# Altium schematic sheet Audio Jack schematic.SchDoc
size A4
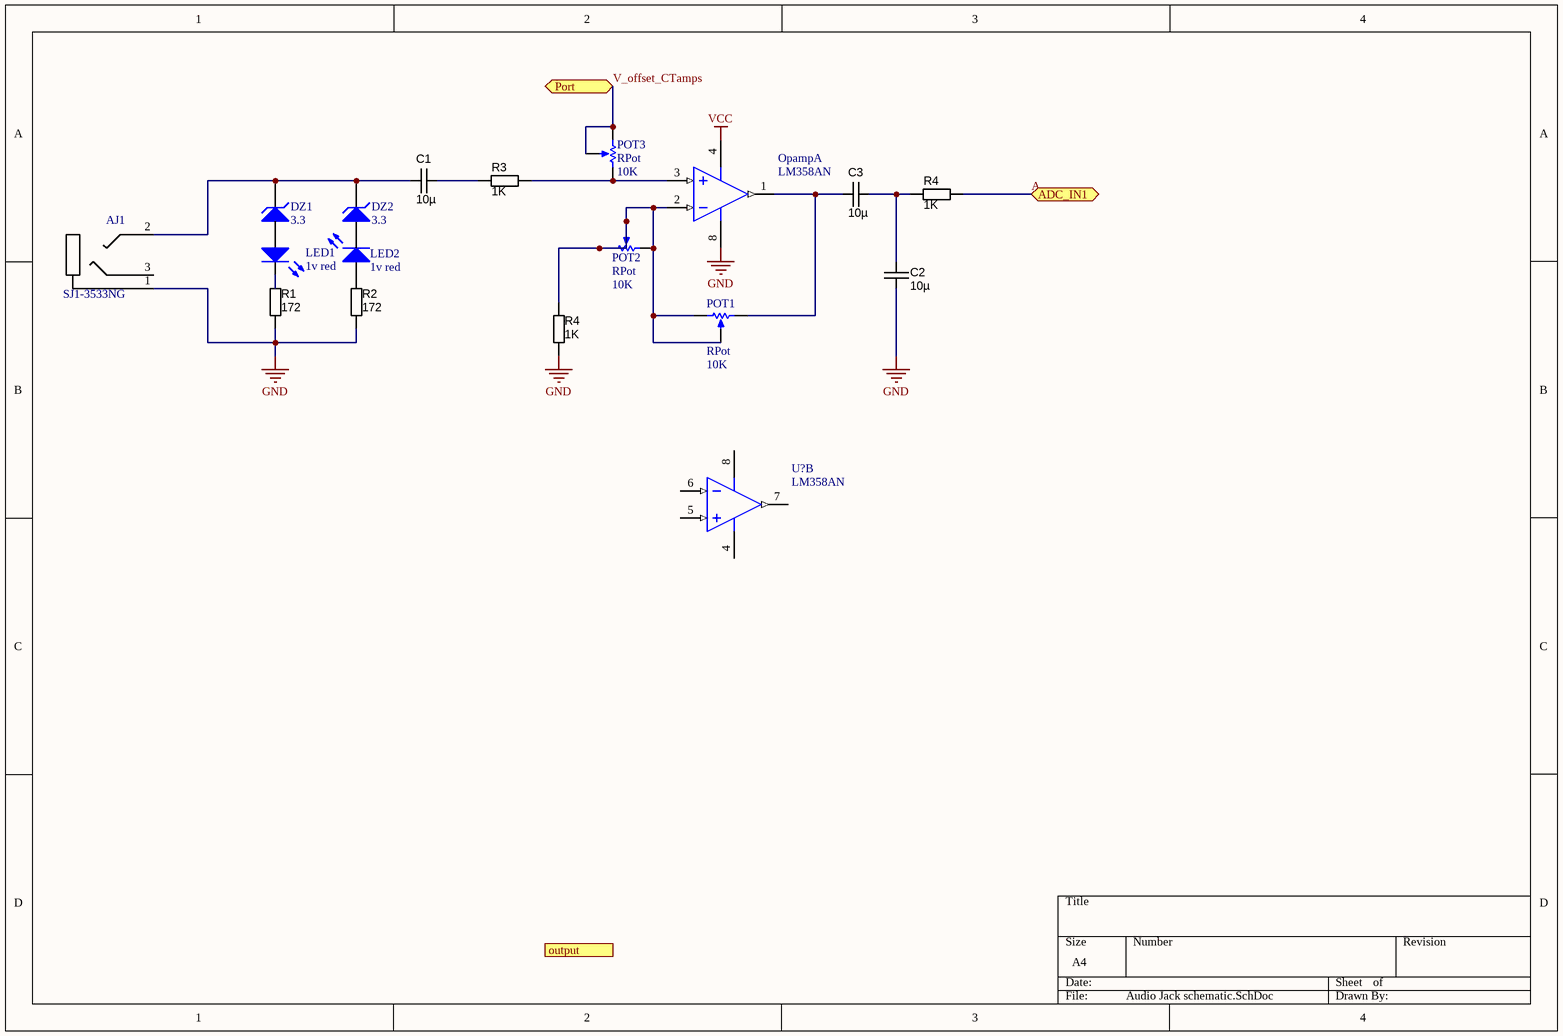
[diagram p0: Audio Jack schematic.SchDoc]

## Parts
(Parts that share a designator on the sheet are numbered #1, #2 ... from top to bottom, then left to right.)
1v_red  LED2  [LED-1]
AJ1  SJ1-3533NG  [SJ1-3533NG]
C1  value 10µ  [CAPC2012N]  (hidden comment: approved sub OK)
C2  value 10µ  [CAPC2012N]  (hidden comment: approved sub OK)
C3  value 10µ  [CAPC2012N]  (hidden comment: approved sub OK)
DZ1  3.3  [DIODE-0.7]
DZ2  3.3  [DIODE-0.7]
LED1  1v red  [LED-1]
Opamp  LM358AN  [N08E]  (part A of 2)
POT1  RPot  value 10K  [VR5]
POT2  RPot  value 10K  [VR5]
POT3  RPot  value 10K  [VR5]
R1  value 172  [RESC2012N_ZERO]  (hidden comment: Thick Film)
R2  value 172  [RESC2012N_ZERO]  (hidden comment: Thick Film)
R3  value 1K  [RESC2012N_ZERO]  (hidden comment: Thick Film)
R4#1  value 1K  [RESC2012N_ZERO]  (hidden comment: Thick Film)
R4#2  value 1K  [RESC2012N_ZERO]  (hidden comment: Thick Film)
U?  LM358AN  [N08E]  (part B of 2)

## Ports
ADC_IN1, output, Port

## Nets
GND: AJ1.1(S) C2.2 Opamp.8(V+) R1.1 R2.1 R4#2.2
VCC: Opamp.4(GND)
A: R4#1.1 ; port ADC_IN1
V_offset_CTamps: POT3.1(TOP) POT3.3(TAP) ; port Port
NetAJ1_2: AJ1.2(T) C1.2 DZ1.2(K) DZ2.2(K)
NetC1_1: C1.1 R3.1
NetC2_1: C2.1 C3.2 R4#1.2
NetC3_1: C3.1 Opamp.1(OUTA) POT1.2(BOT)
NetLED1_2: LED1.2(K) R1.2
NetOpamp_2: Opamp.2(INA-) POT1.1(TOP) POT1.3(TAP) POT2.1(TOP) POT2.2(BOT) POT2.3(TAP) R4#2.1
NetOpamp_3: Opamp.3(INA+) POT3.2(BOT) R3.2

Not connected (* = marked no-connect by the designer): 1v_red 1(A) 2(K); AJ1 3(R); DZ1 1(A); DZ2 1(A); LED1 1(A); R2 2; U? 4(GND) 5(INB+) 6(INB-) 7(OUTB) 8(V+)

## Library data of the parts
1v_red LED1 = LED1: Typical RED GaAs LED; Published: 8-Jun-2000; LatestRevisionDate: 08-Jul-2005; LatestRevisionNote: Mech Layer 1 removed.; PackageReference: LED-1; Publisher: Altium Limited; PackageDescription: LED; 2 Leads
AJ1 = SJ1-3533NG: SJ1 Series 3.5 mm 12 V Right Angle Through Hole Isolated Stereo Audio Jack; MF: CUI; Availability: Good; Package: None; MP: SJ1-3533NG; Price: 0.77 USD; Value: *
C1-C3 = CAPC_10u_0805_16V: Capacitor SMD Cer 10uF 10% 16V X7R 0805; Manufacturer 1: Samsung; Manufacturer Part Number 1: CL21B106KBN; Ratings: 16V; X7R; Material: ceramic; Package / Case: 0805 (2012 metric); Tolerance: ±10%
DZ1 DZ2 = D Zener: Zener Diode; Published: 8-Jun-2000; LatestRevisionDate: 17-Jul-2002; LatestRevisionNote: Re-released for DXP Platform.; PackageReference: DIODE-0.7; Publisher: Altium Limited; PackageDescription: Diode, Thru-Hole; 2 Leads; 0.7 in Pin Spacing
Opamp U? = CMP-0055-00164-2: Low Power Dual Operational Amplifier, 8-pin MDIP; Manufacturer: National Semiconductor; CompType: Amplifiers; PackageTopMarking: NSUZXYTTE#*LM*358AN; PowerWise: N; ComponentLink2Description: LM358 Web Page; Code_JEDEC: MS-001-BA; ComponentLink3Description: N08E Package Page; PinCount: 8; PackageReference: N08E; ComponentLink3URL: http://www.national.com/packaging/folders/n08e.html; PackageVersion: revG, May-2006; RevisionNote: Component URLs added; DatasheetVersion: Oct-2005; ComponentLink1URL: http://www.national.com/ds/LM/LM358.pdf; PackageDescription: MDIP, .365 x .250 x .130in, 8 Lead, .100in Pitch; ComponentLink2URL: http://www.national.com/pf/LM/LM358.html; ComponentLink1Description: LM358 Datasheet; RoHS: N
  Opamp: PartId: 1
  U?: PartId: 2
POT1-POT3 = RPot: Potentiometer; Sim Note: Enter the Resistance value and the set point into parameter fields.; Set Position: 0.5; Published: 8-Jun-2000; LatestRevisionDate: 17-Jul-2002; LatestRevisionNote: Re-released for DXP Platform.; PackageReference: VR5; Publisher: Altium Limited; PackageDescription: Variable Resistor, Thru-Hole; 3 Leads
R1-R3 R4#1 R4#2 = RES_0R_0805: Resistor SMD chip 0.0 Ohm 0.125W 0805; Manufacturer 1: Rohm Semiconductor; Manufacturer Part Number 1: MCR10EZPJ000; Tolerance: ±5%; Ratings: 1/8W; Package / Case: 0805 (2012 metric)